# EAGLE design HUB75 (EAGLE 9.6.2)
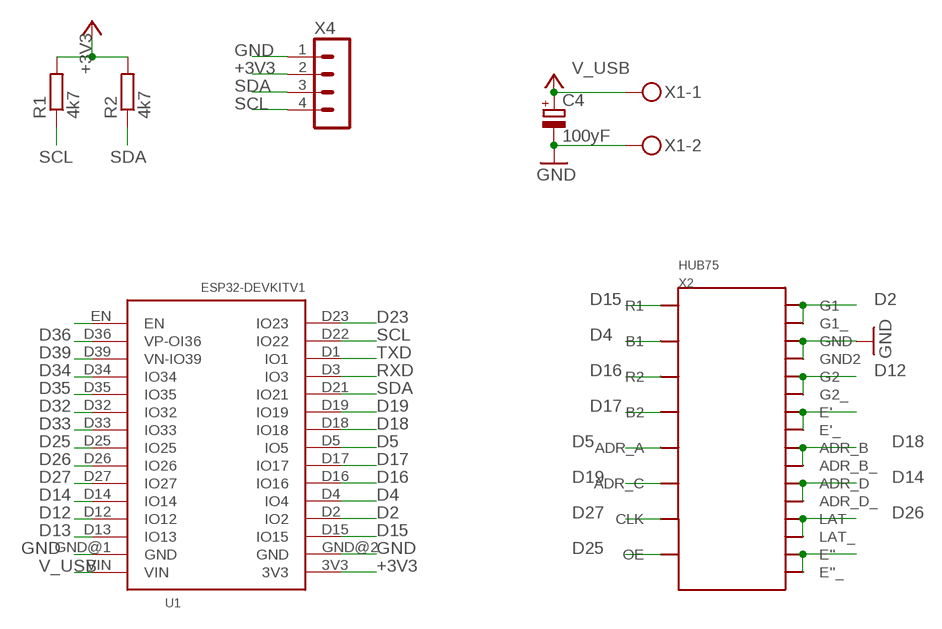
[diagram p0: schematic, sheet 1]

## Parts
C4  100yF  CPOL-EUE5-6  [E5-6]
R1  4k7  R-EU_R0805  [R0805]
R2  4k7  R-EU_R0805  [R0805]
U1  ESP32DEVKITV1  [ESP32-DEVKITV1]
X1  MKDSN1,5/2-5,08  [MKDSN1,5/2-5,08]
X2  HUB75  [3X8]
X4  B4B-PH-K  [B4B-PH-K]

## Nets
+3V3: R1.2 R2.2 U1.3V3 X4.2
D2: U1.D2(IO2) X2.2(G1) X2.2B(G1_)
D4: U1.D4(IO4) X2.3(B1)
D5: U1.D5(IO5) X2.9(ADR_A)
D12: U1.D12(IO12) X2.6(G2) X2.6B(G2_)
D13: U1.D13(IO13)
D14: U1.D14(IO14) X2.12(ADR_D) X2.12B(ADR_D_)
D15: U1.D15(IO15) X2.1(R1)
D16: U1.D16(IO16) X2.5(R2)
D17: U1.D17(IO17) X2.7(B2)
D18: U1.D18(IO18) X2.10(ADR_B) X2.10B(ADR_B_)
D19: U1.D19(IO19) X2.11(ADR_C)
D23: U1.D23(IO23)
D25: U1.D25(IO25) X2.15(OE)
D26: U1.D26(IO26) X2.14(LAT) X2.14B(LAT_)
D27: U1.D27(IO27) X2.13(CLK)
D32: U1.D32(IO32)
D33: U1.D33(IO33)
D34: U1.D34(IO34)
D35: U1.D35(IO35)
D36: U1.D36(VP-OI36)
D39: U1.D39(VN-IO39)
GND: C4.- U1.GND@1(GND) U1.GND@2(GND) X1.2 X2.4(GND) X2.4B(GND2) X4.1
N$4: X2.8(E') X2.8B(E'_)
N$8: X2.16(E'') X2.16B(E''_)
N$17: U1.EN
RXD: U1.D3(IO3)
SCL: R1.1 U1.D22(IO22) X4.4
SDA: R2.1 U1.D21(IO21) X4.3
TXD: U1.D1(IO1)
V_USB: C4.+ U1.VIN X1.1 ; supply symbol labelled V+

## Library data of the parts
C4 = rcl:CPOL-EU: POLARIZED CAPACITOR, European symbol; SPICEPREFIX: C
R1 R2 = rcl:R-EU_: RESISTOR, European symbol; SPICEPREFIX: R
U1 = ESP32-DEVKITV1:ESP32DEVKITV1
X1 = con-phoenix-508:MKDSN1,5/2-5,08: MKDSN 1,5/ 2-5,08 Printklemme Nennstrom: 13,5 A Nennspannung: 250 V Rastermaß: 5,08 mm Polzahl: 2 Anschlussart: Schraubanschluss Montage: Löten Anschlussrichtung Leiter/Platine: 0 ° Artikelnummer: 1729128 Source: http://eshop.phoenixcontact.com .. 1729128.pdf
X2 = con-3x8:HUB75
X4 = con-jst-ph:B4B-PH-K: HEADER

## Board
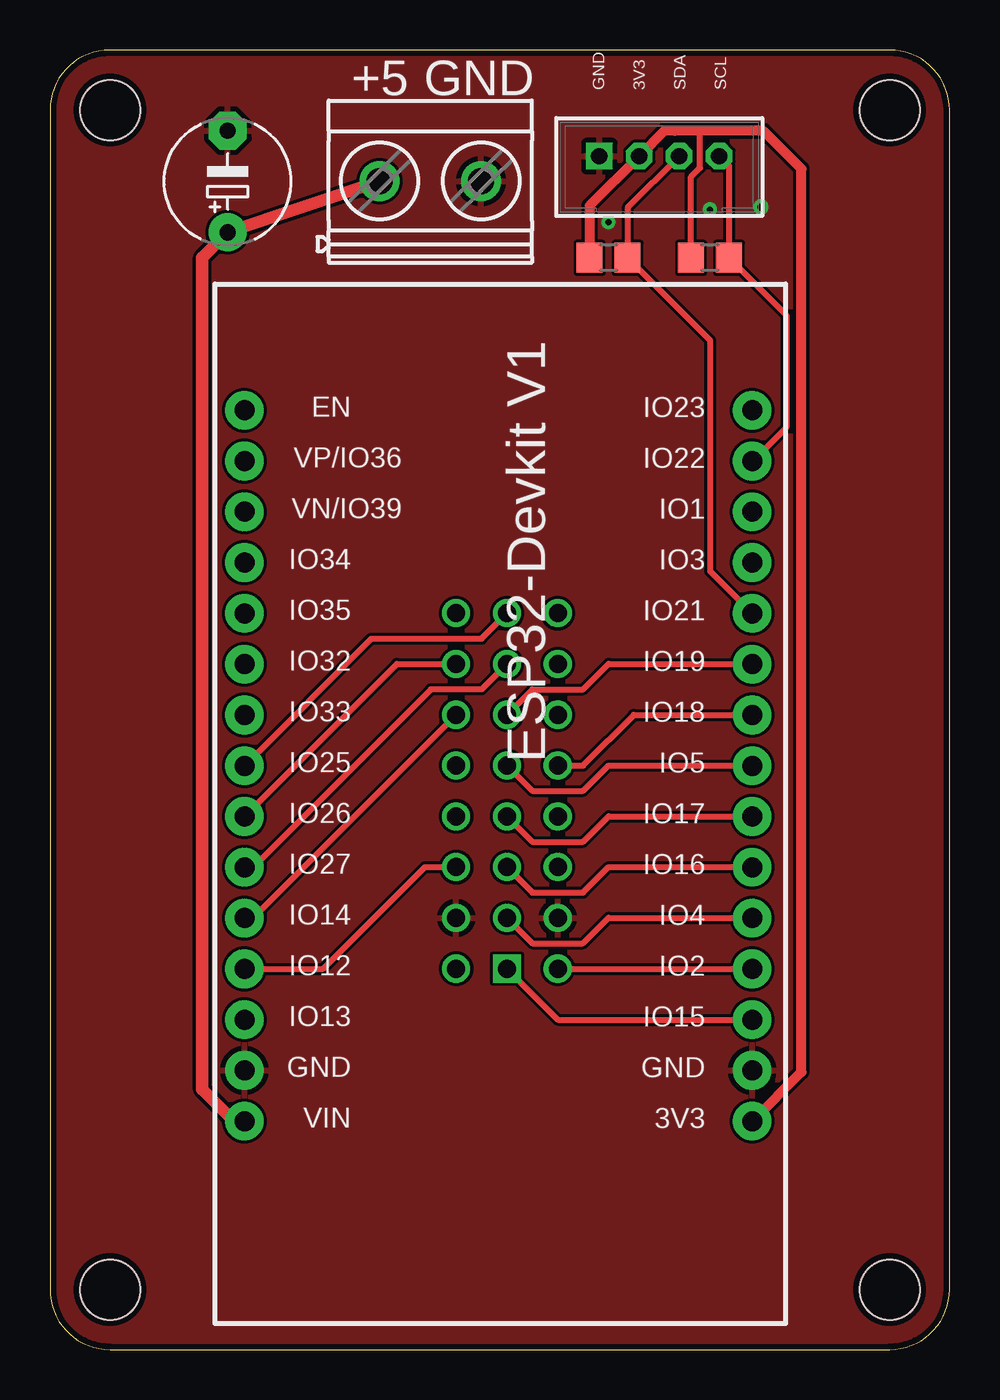
[diagram p1: board, top side]
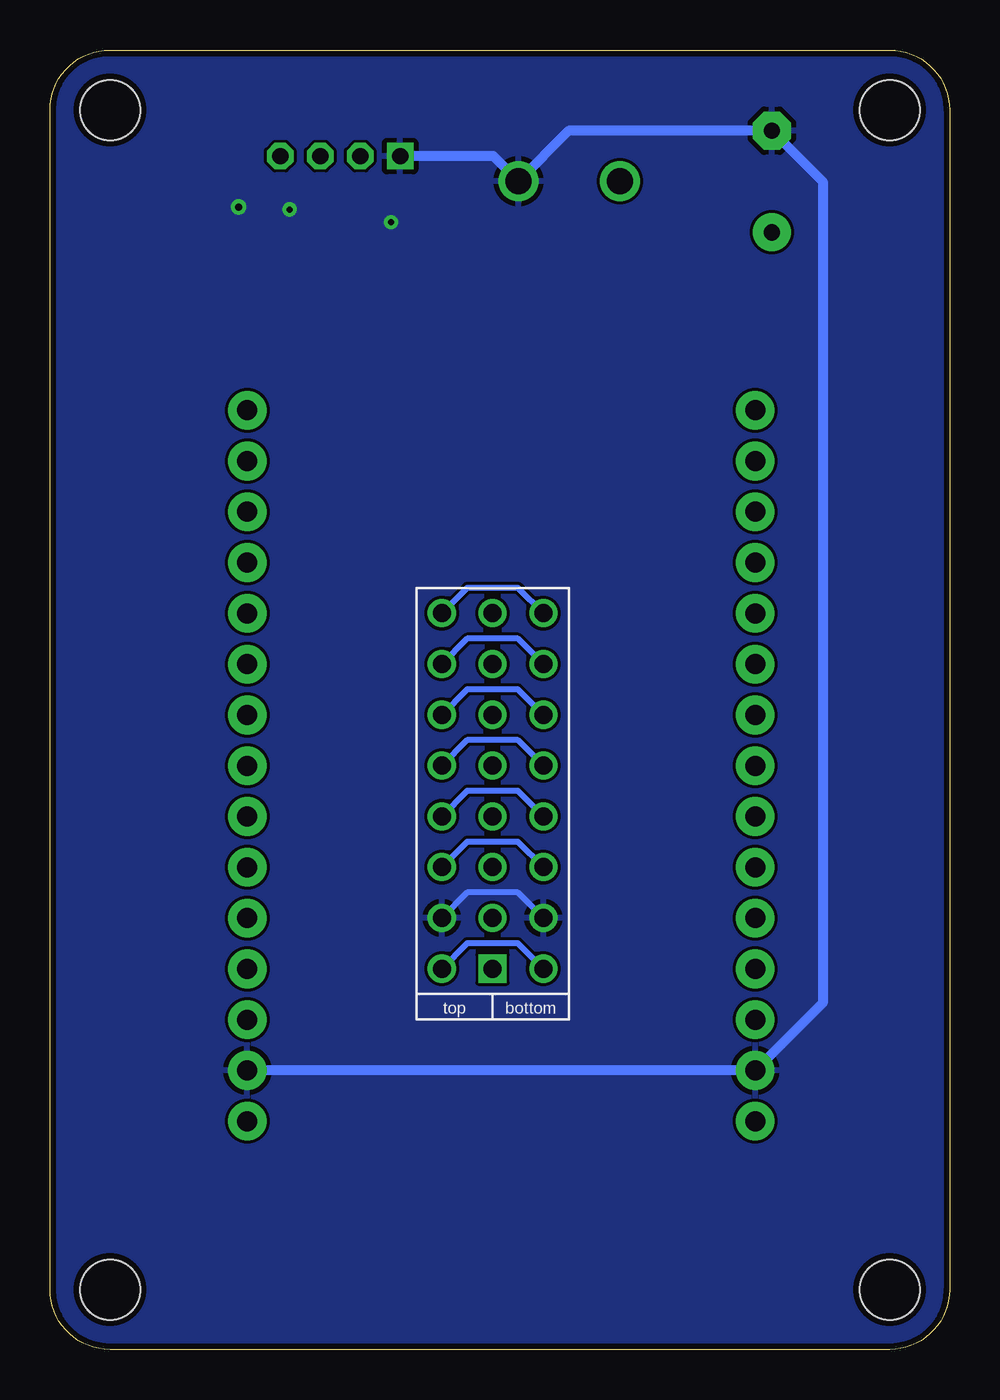
[diagram p2: board, bottom side, seen from below]

Size 45 x 65 mm. Coordinates in mm from the lower left corner, seen from the top.
Outline: 0,62 0,3 arc90 3,0 42,0 arc90 45,3 45,62 arc90 42,65 3,65 arc90 0,62
Copper layers (1*16): Top 0.035mm / dielectric 1.5mm / Bottom 0.035mm
Design rules "Seeed": minimum track width 6mil, minimum drill 0.3mm, track to track 6mil, track to pad 6mil, pad to pad 6mil, via to via 12mil, smd to smd 6mil, copper to edge 12mil, drill to drill 6mil, minimum pad ring 10mil, minimum via ring 8mil, stop-mask expansion 4mil, vias tented up to drill 20mil, thermal gap 10mil
Holes 3 mm at 3,3 42,3 42,62 3,62

### Footprints (pad centres in the part's own frame; a part is rotated, then mirrored left to right if it is on the bottom)
E5-6 = drill 0.813 pad 1.905: + -2.54,0 | drill 0.813 pad 1.905 octagon: - 2.54,0
R0805 = smd 1.3 x 1.5: 1 -0.95,0; 2 0.95,0
ESP32-DEVKITV1 = drill 1 pad 1.93: 3V3 -16.52,-12.27; D1 13.96,-12.27; D2 -8.9,-12.27; D3 11.42,-12.27; D4 -6.36,-12.27; D5 1.26,-12.27; D12 -8.9,13.135; D13 -11.44,13.135; D14 -6.36,13.135; D15 -11.44,-12.27; D16 -3.82,-12.27; D17 -1.28,-12.27; D18 3.8,-12.27; D19 6.34,-12.27; D21 8.88,-12.27; D22 16.5,-12.27; D23 19.04,-12.27; D25 1.26,13.135; D26 -1.28,13.135; D27 -3.82,13.135; D32 6.34,13.135; D33 3.8,13.135; D34 11.42,13.135; D35 8.88,13.135; D36 16.5,13.135; D39 13.96,13.135; EN 19.04,13.135; GND@1 -13.98,13.135; GND@2 -13.98,-12.27; VIN -16.52,13.135
MKDSN1,5/2-5,08 = drill 1.3 pad 2: 1 -2.561,0.025; 2 2.519,0.025
3X8 = drill 0.9 square: 1 0,2.54 | drill 0.9: 2 0,5.08; 2B 0,0; 3 2.54,2.54; 4 2.54,5.08; 4B 2.54,0; 5 5.08,2.54; 6 5.08,5.08; 6B 5.08,0; 7 7.62,2.54; 8 7.62,5.08; 8B 7.62,0; 9 10.16,2.54; 10 10.16,5.08; 10B 10.16,0; 11 12.7,2.54; 12 12.7,5.08; 12B 12.7,0; 13 15.24,2.54; 14 15.24,5.08; 14B 15.24,0; 15 17.78,2.54; 16 17.78,5.08; 16B 17.78,0
B4B-PH-K = drill 0.813 square: 1 -3,0 | drill 0.813 octagon: 2 -1,0; 3 1,0; 4 3,0

### Placement (x,y rotation side)
C4  8.89,58.42 90 top
R1  33.02,54.61 180 top
R2  27.94,54.61 180 top
U1  22.86,27.94 90 top
X1  19.05,58.42 0 top
X2  20.32,19.05 90 bottom
X4  30.48,59.69 0 top

### Tracks (layer width: path | path; a pad name or v marks a point on that pad's centre or on a via)
+3V3
  Top 0.305: R1.2 32.07,58.66 32.52,59.11 32.52,60.96
  Top 0.508: R2.2 26.99,57.2 X4.2 30.75,60.96 31.25,60.96 32.52,60.96 35.69,60.96 37.59,59.05 37.59,13.88 U1.3V3
D2
  Top 0.305: X2.2 U1.D2
  Bottom 0.305: X2.2B 21.59,20.32 24.13,20.32 X2.2
D4
  Top 0.305: X2.3 24.13,20.32 26.67,20.32 27.94,21.59 U1.D4
D5
  Top 0.305: X2.9 24.13,27.94 26.67,27.94 27.94,29.21 U1.D5
D12
  Top 0.305: U1.D12 13.66,19.04 18.75,24.13 X2.6B
  Bottom 0.305: X2.6B 21.59,25.4 24.13,25.4 X2.6
D14
  Top 0.305: X2.12B 10.15,21.58 U1.D14
  Bottom 0.305: X2.12B 21.59,33.02 24.13,33.02 X2.12
D15
  Top 0.305: U1.D15 25.41,16.5 X2.1
D16
  Top 0.305: X2.5 24.13,22.86 26.67,22.86 27.94,24.13 U1.D16
D17
  Top 0.305: X2.7 24.13,25.4 26.67,25.4 27.94,26.67 U1.D17
D18
  Top 0.305: X2.10 26.67,29.21 29.21,31.75 U1.D18
  Bottom 0.305: X2.10B 21.59,30.48 24.13,30.48 X2.10
D19
  Top 0.305: X2.11 24.13,33.02 26.67,33.02 27.94,34.29 U1.D19
D25
  Top 0.305: U1.D25 16.09,35.56 21.59,35.56 X2.15
D26
  Top 0.305: U1.D26 17.36,34.29 X2.14B
  Bottom 0.305: X2.14B 21.59,35.56 24.13,35.56 X2.14
D27
  Top 0.305: X2.13 21.59,33.02 19.05,33.02 10.15,24.12 U1.D27
GND  (via drill 0.3, 0.35)
  Bottom 0.305: X2.4B 21.59,22.86 24.13,22.86 X2.4
  Bottom 0.508: X4.1 22.81,59.69 X1.2 19.05,60.96 C4.- 6.35,58.42 6.35,17.34 U1.GND@1 U1.GND@2
  other vias: 35.56,57.15 27.94,56.39 33.02,57.02
  pour Top: -1.27,-2.54 -1.27,66.04 46.99,66.04 46.99,-2.54
  pour Bottom: -1.27,-2.54 -1.27,66.04 46.99,66.04 46.99,-2.54
N$4
  Bottom 0.305: X2.8B 21.59,27.94 24.13,27.94 X2.8
N$8
  Bottom 0.305: X2.16B 21.59,38.1 24.13,38.1 X2.16
SCL
  Top 0.305: X4.4 33.97,59.2 R1.1 36.83,51.75 36.83,46.1 35.17,44.44 U1.D22
SDA
  Top 0.305: X4.3 28.89,57.1 R2.1 33.02,50.48 33.02,38.93 U1.D21
V_USB
  Top 0.635: U1.VIN 9.22,11.42 7.62,13.02 7.62,54.61 C4.+ X1.1

### Text on the board
tPlace: +5 | GND | GND | 3V3 | SDA | SCL